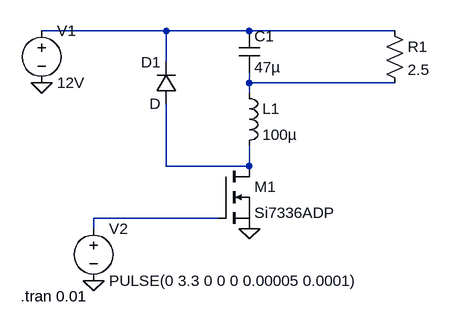
[diagram p0: schematic Pelt_Driver.asc]
Pelt_Driver.asc, the LTspice schematic file:
Version 4
SHEET 1 880 680
WIRE 64 -64 -128 -64
WIRE 192 -64 64 -64
WIRE 416 -64 192 -64
WIRE 64 -16 64 -64
WIRE 192 16 192 0
WIRE 416 16 192 16
WIRE 192 32 192 16
WIRE 64 144 64 48
WIRE 192 144 192 112
WIRE 192 144 64 144
WIRE 144 224 -48 224
WIRE -48 240 -48 224
FLAG -128 16 0
FLAG -48 320 0
FLAG 192 240 0
SYMBOL nmos 144 144 R0
SYMATTR InstName M1
SYMATTR Value Si7336ADP
SYMBOL ind 176 16 R0
SYMATTR InstName L1
SYMATTR Value 100µ
SYMBOL cap 176 -64 R0
SYMATTR InstName C1
SYMATTR Value 47µ
SYMBOL voltage -128 -80 R0
WINDOW 123 0 0 Left 2
WINDOW 39 0 0 Left 2
SYMATTR InstName V1
SYMATTR Value 12V
SYMBOL voltage -48 224 R0
WINDOW 123 0 0 Left 2
WINDOW 39 0 0 Left 2
SYMATTR InstName V2
SYMATTR Value PULSE(0 3.3 0 0 0 0.00005 0.0001)
SYMBOL res 400 -80 R0
SYMATTR InstName R1
SYMATTR Value 2.5
SYMBOL diode 80 48 R180
WINDOW 0 24 64 Left 2
WINDOW 3 24 0 Left 2
SYMATTR InstName D1
TEXT -160 344 Left 2 !.tran 0.01

The netlist it stands for:
* Pelt_Driver.asc
M1 N003 N004 0 0 Si7336ADP
L1 N002 N003 100µ
C1 N001 N002 47µ
V1 N001 0 12V
V2 N004 0 PULSE(0 3.3 0 0 0 0.00005 0.0001)
R1 N001 N002 2.5
D1 N003 N001 D
.model D D
.lib standard.dio
.model NMOS NMOS
.model PMOS PMOS
.lib standard.mos
.tran 0.01
.backanno
.end